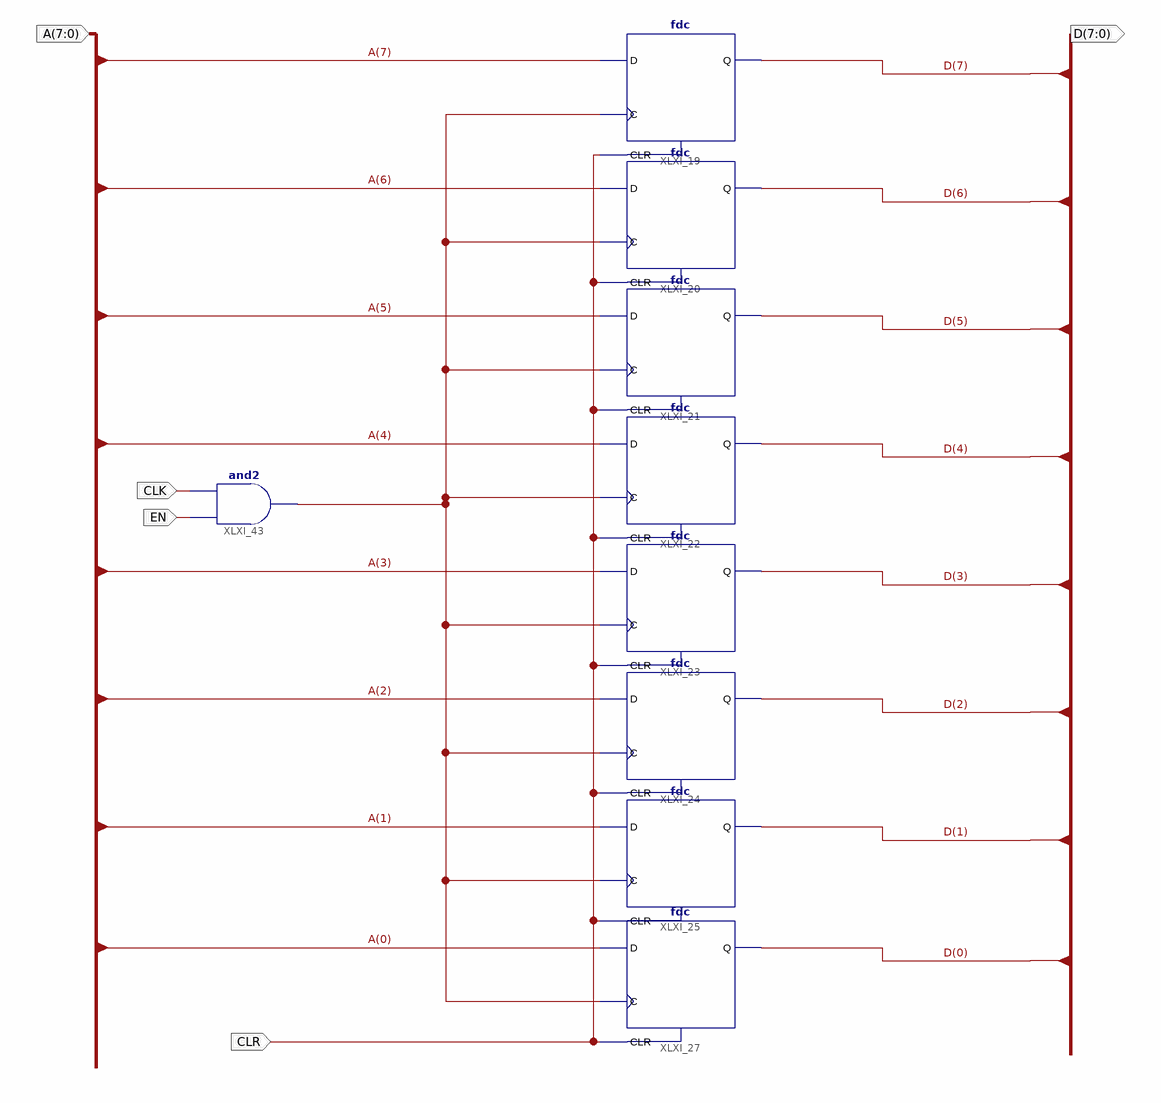
[diagram p0: schematic sheet 1]
// Xilinx ISE schematic REG8.sch (spartan3e) as structural Verilog: 9 symbols, 5 ports
module REG8 (
  input  [7:0] A,
  input  CLR,
  input  CLK,
  input  EN,
  output [7:0] D
);

  wire XLXN_57;

  fdc XLXI_19 (.C(XLXN_57), .CLR(CLR), .D(A[7]), .Q(D[7]));
  fdc XLXI_20 (.C(XLXN_57), .CLR(CLR), .D(A[6]), .Q(D[6]));
  fdc XLXI_21 (.C(XLXN_57), .CLR(CLR), .D(A[5]), .Q(D[5]));
  fdc XLXI_22 (.C(XLXN_57), .CLR(CLR), .D(A[4]), .Q(D[4]));
  fdc XLXI_23 (.C(XLXN_57), .CLR(CLR), .D(A[3]), .Q(D[3]));
  fdc XLXI_24 (.C(XLXN_57), .CLR(CLR), .D(A[2]), .Q(D[2]));
  fdc XLXI_25 (.C(XLXN_57), .CLR(CLR), .D(A[1]), .Q(D[1]));
  fdc XLXI_27 (.C(XLXN_57), .CLR(CLR), .D(A[0]), .Q(D[0]));
  and XLXI_43 (XLXN_57, EN, CLK);
endmodule
